# EAGLE schematic Proto Business Card (EAGLE 7.3.0)
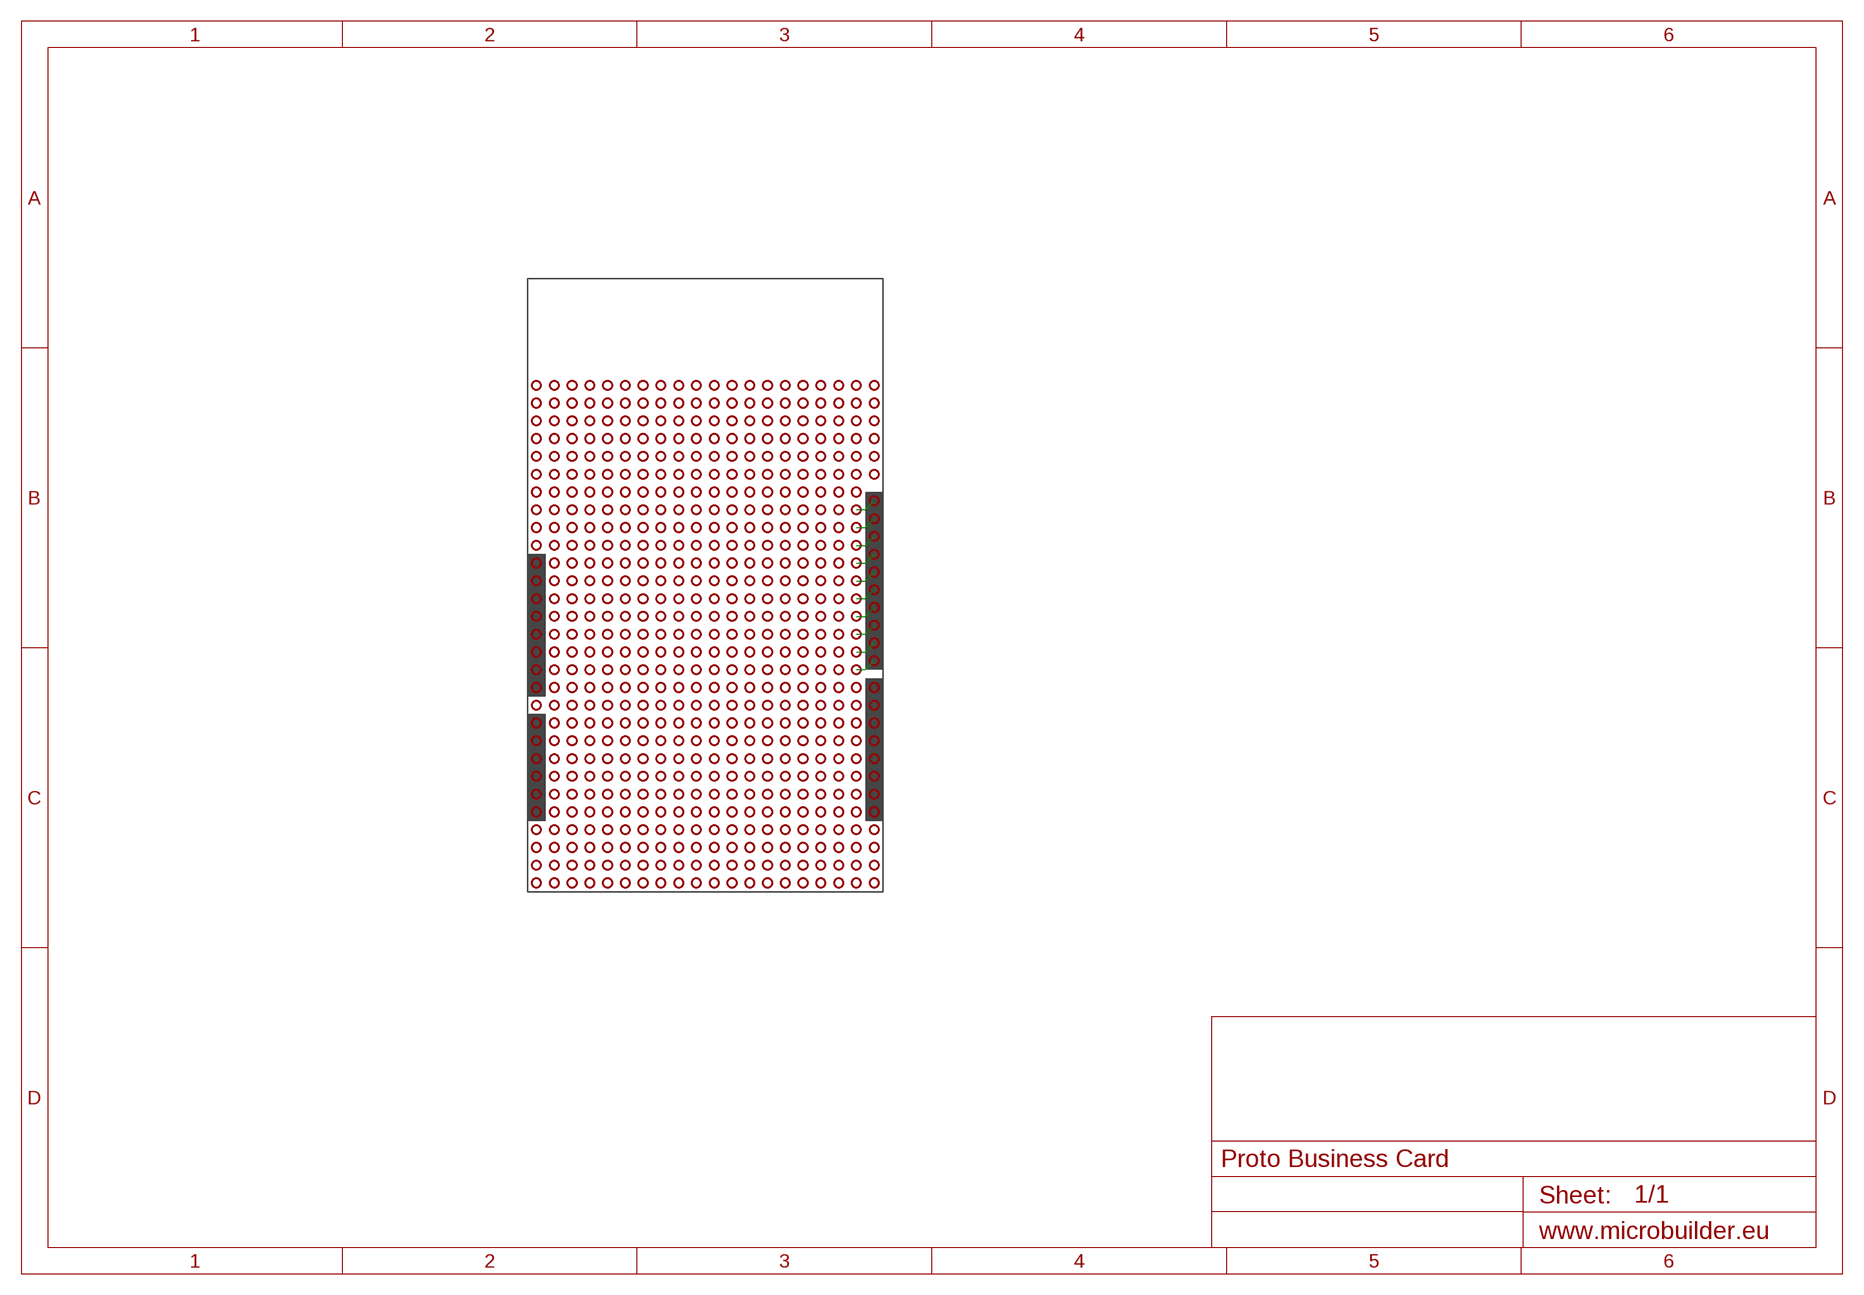
[diagram p0: schematic, sheet 1]

## Parts
U$1  VIA.2-2.CORNER  [2-2.CORNER]
U$2  VIA.3-3  [3-3]
U$3  VIA.2-2.CORNER  [2-2.CORNER]
U$4  VIA.3-3  [3-3]
U$5  VIA.3-3  [3-3]
U$6  VIA.3-3  [3-3]
U$7  VIA.3-3  [3-3]
U$8  VIA.3-3  [3-3]
U$9  VIA.3-3  [3-3]
U$10  VIA.3-3  [3-3]
U$11  VIA.3-3  [3-3]
U$12  VIA.3-3  [3-3]
U$13  VIA.3-3  [3-3]
U$14  VIA.3-3  [3-3]
U$15  VIA.3-3  [3-3]
U$16  VIA.3-3  [3-3]
U$17  VIA.3-3  [3-3]
U$18  VIA.3-3  [3-3]
U$19  VIA.3-3  [3-3]
U$20  VIA.3-3  [3-3]
U$21  VIA.2-2.CORNER  [2-2.CORNER]
U$22  VIA.3-3  [3-3]
U$23  VIA.3-3  [3-3]
U$24  VIA.3-3  [3-3]
U$25  VIA.3-3  [3-3]
U$26  VIA.3-3  [3-3]
U$27  VIA.3-3  [3-3]
U$28  VIA.3-3  [3-3]
U$29  VIA.3-3  [3-3]
U$30  VIA.3-3  [3-3]
U$31  VIA.3-3  [3-3]
U$32  VIA.3-3  [3-3]
U$33  VIA.3-3  [3-3]
U$34  VIA.3-3  [3-3]
U$35  VIA.3-3  [3-3]
U$36  VIA.3-3  [3-3]
U$37  VIA.2-2.CORNER  [2-2.CORNER]
U$38  VIA.4-4  [4-4]
U$39  VIA.4-4  [4-4]
U$40  VIA.4-4  [4-4]
U$41  VIA.4-4  [4-4]
U$42  VIA.4-4  [4-4]
U$43  VIA.4-4  [4-4]
U$44  VIA.4-4  [4-4]
U$45  VIA.3-3  [3-3]
U$46  VIA.3-3  [3-3]
U$47  VIA.4-4  [4-4]
U$48  VIA.4-4  [4-4]
U$49  VIA.4-4  [4-4]
U$50  VIA.4-4  [4-4]
U$51  VIA.4-4  [4-4]
U$52  VIA.4-4  [4-4]
U$53  VIA.4-4  [4-4]
U$54  VIA.4-4  [4-4]
U$55  VIA.4-4  [4-4]
U$56  VIA.4-4  [4-4]
U$57  VIA.4-4  [4-4]
U$58  VIA.4-4  [4-4]
U$59  VIA.4-4  [4-4]
U$60  VIA.4-4  [4-4]
U$61  VIA.4-4  [4-4]
U$62  VIA.4-4  [4-4]
U$63  VIA.4-4  [4-4]
U$64  VIA.4-4  [4-4]
U$65  VIA.4-4  [4-4]
U$66  VIA.4-4  [4-4]
U$67  VIA.4-4  [4-4]
U$68  VIA.4-4  [4-4]
U$69  VIA.4-4  [4-4]
U$70  VIA.4-4  [4-4]
U$71  VIA.4-4  [4-4]
U$72  VIA.4-4  [4-4]
U$73  VIA.4-4  [4-4]
U$74  VIA.NONE  [NONE]
U$75  VIA.NONE  [NONE]
U$76  VIA.4-4  [4-4]
U$77  VIA.3-3  [3-3]
U$78  VIA.3-3  [3-3]
U$79  VIA.4-4  [4-4]
U$80  VIA.4-4  [4-4]
U$81  VIA.4-4  [4-4]
U$82  VIA.4-4  [4-4]
U$83  VIA.4-4  [4-4]
U$84  VIA.4-4  [4-4]
U$85  VIA.4-4  [4-4]
U$86  VIA.4-4  [4-4]
U$87  VIA.4-4  [4-4]
U$88  VIA.4-4  [4-4]
U$89  VIA.4-4  [4-4]
U$90  VIA.4-4  [4-4]
U$91  VIA.4-4  [4-4]
U$92  VIA.4-4  [4-4]
U$93  VIA.4-4  [4-4]
U$94  VIA.4-4  [4-4]
U$95  VIA.NONE  [NONE]
U$96  VIA.NONE  [NONE]
U$97  VIA.NONE  [NONE]
U$98  VIA.NONE  [NONE]
U$99  VIA.NONE  [NONE]
U$100  VIA.NONE  [NONE]
U$101  VIA.4-4  [4-4]
U$102  VIA.4-4  [4-4]
U$103  VIA.4-4  [4-4]
U$104  VIA.4-4  [4-4]
U$105  VIA.4-4  [4-4]
U$106  VIA.4-4  [4-4]
U$107  VIA.4-4  [4-4]
U$108  VIA.4-4  [4-4]
U$109  VIA.4-4  [4-4]
U$110  VIA.4-4  [4-4]
U$111  VIA.4-4  [4-4]
U$112  VIA.3-3  [3-3]
U$113  VIA.3-3  [3-3]
U$114  VIA.4-4  [4-4]
U$115  VIA.4-4  [4-4]
U$116  VIA.4-4  [4-4]
U$117  VIA.4-4  [4-4]
U$118  VIA.4-4  [4-4]
U$119  VIA.4-4  [4-4]
U$120  VIA.3-3  [3-3]
U$121  VIA.3-3  [3-3]
U$122  VIA.3-3  [3-3]
U$123  VIA.3-3  [3-3]
U$124  VIA.3-3  [3-3]
U$125  VIA.3-3  [3-3]
U$126  VIA.4-4  [4-4]
U$127  VIA.4-4  [4-4]
U$128  VIA.4-4  [4-4]
U$129  VIA.4-4  [4-4]
U$130  VIA.4-4  [4-4]
U$131  VIA.4-4  [4-4]
U$132  VIA.4-4  [4-4]
U$133  VIA.4-4  [4-4]
U$134  VIA.4-4  [4-4]
U$135  VIA.4-4  [4-4]
U$136  VIA.4-4  [4-4]
U$137  VIA.4-4  [4-4]
U$138  VIA.4-4  [4-4]
U$139  VIA.4-4  [4-4]
U$140  VIA.4-4  [4-4]
U$141  VIA.4-4  [4-4]
U$142  VIA.4-4  [4-4]
U$143  VIA.4-4  [4-4]
U$144  VIA.4-4  [4-4]
U$145  VIA.3-3  [3-3]
U$146  VIA.3-3  [3-3]
U$147  VIA.4-4  [4-4]
U$148  VIA.NONE  [NONE]
U$149  VIA.NONE  [NONE]
U$150  VIA.3-3  [3-3]
U$151  VIA.4-4  [4-4]
U$152  VIA.3-3  [3-3]
U$153  VIA.3-3  [3-3]
U$154  VIA.4-4  [4-4]
U$155  VIA.4-4  [4-4]
U$156  VIA.4-4  [4-4]
U$157  VIA.4-4  [4-4]
U$158  VIA.4-4  [4-4]
U$159  VIA.4-4  [4-4]
U$160  VIA.4-4  [4-4]
U$161  VIA.4-4  [4-4]
U$162  VIA.4-4  [4-4]
U$163  VIA.4-4  [4-4]
U$164  VIA.4-4  [4-4]
U$165  VIA.4-4  [4-4]
U$166  VIA.4-4  [4-4]
U$167  VIA.4-4  [4-4]
U$168  VIA.4-4  [4-4]
U$169  VIA.4-4  [4-4]
U$170  VIA.3-3  [3-3]
U$171  VIA.4-4  [4-4]
U$172  VIA.4-4  [4-4]
U$173  VIA.4-4  [4-4]
U$174  VIA.4-4  [4-4]
U$175  VIA.4-4  [4-4]
U$176  VIA.4-4  [4-4]
U$177  VIA.4-4  [4-4]
U$178  VIA.4-4  [4-4]
U$179  VIA.4-4  [4-4]
U$180  VIA.4-4  [4-4]
U$181  VIA.4-4  [4-4]
U$182  VIA.3-3  [3-3]
U$183  VIA.3-3  [3-3]
U$184  VIA.4-4  [4-4]
U$185  VIA.4-4  [4-4]
U$186  VIA.4-4  [4-4]
U$187  VIA.4-4  [4-4]
U$188  VIA.4-4  [4-4]
U$189  VIA.4-4  [4-4]
U$190  VIA.4-4  [4-4]
U$191  VIA.4-4  [4-4]
U$192  VIA.4-4  [4-4]
U$193  VIA.4-4  [4-4]
U$194  VIA.4-4  [4-4]
U$195  VIA.4-4  [4-4]
U$196  VIA.4-4  [4-4]
U$197  VIA.4-4  [4-4]
U$198  VIA.4-4  [4-4]
U$199  VIA.4-4  [4-4]
U$200  VIA.4-4  [4-4]
U$201  VIA.4-4  [4-4]
U$202  VIA.4-4  [4-4]
U$203  VIA.4-4  [4-4]
U$204  VIA.4-4  [4-4]
U$205  VIA.4-4  [4-4]
U$206  VIA.4-4  [4-4]
U$207  VIA.4-4  [4-4]
U$208  VIA.4-4  [4-4]
U$209  VIA.4-4  [4-4]
U$210  VIA.4-4  [4-4]
U$211  VIA.3-3  [3-3]
U$212  VIA.3-3  [3-3]
U$213  VIA.4-4  [4-4]
U$214  VIA.4-4  [4-4]
U$215  VIA.4-4  [4-4]
U$216  VIA.4-4  [4-4]
U$217  VIA.4-4  [4-4]
U$218  VIA.4-4  [4-4]
U$219  VIA.4-4  [4-4]
U$220  VIA.4-4  [4-4]
U$221  VIA.4-4  [4-4]
U$222  VIA.4-4  [4-4]
U$223  VIA.4-4  [4-4]
U$224  VIA.4-4  [4-4]
U$225  VIA.4-4  [4-4]
U$226  VIA.4-4  [4-4]
U$227  VIA.4-4  [4-4]
U$228  VIA.4-4  [4-4]
U$229  VIA.4-4  [4-4]
U$230  VIA.4-4  [4-4]
U$231  VIA.4-4  [4-4]
U$232  VIA.4-4  [4-4]
U$233  VIA.4-4  [4-4]
U$234  VIA.4-4  [4-4]
U$235  VIA.4-4  [4-4]
U$236  VIA.4-4  [4-4]
U$237  VIA.4-4  [4-4]
U$238  VIA.4-4  [4-4]
U$239  VIA.4-4  [4-4]
U$240  VIA.3-3  [3-3]
U$241  VIA.3-3  [3-3]
U$242  VIA.4-4  [4-4]
U$243  VIA.4-4  [4-4]
U$244  VIA.4-4  [4-4]
U$245  VIA.4-4  [4-4]
U$246  VIA.4-4  [4-4]
U$247  VIA.4-4  [4-4]
U$248  VIA.4-4  [4-4]
U$249  VIA.4-4  [4-4]
U$250  VIA.4-4  [4-4]
U$251  VIA.4-4  [4-4]
U$252  VIA.4-4  [4-4]
U$253  VIA.4-4  [4-4]
U$254  VIA.4-4  [4-4]
U$255  VIA.4-4  [4-4]
U$256  VIA.4-4  [4-4]
U$257  VIA.4-4  [4-4]
U$258  VIA.4-4  [4-4]
U$259  VIA.4-4  [4-4]
U$260  VIA.4-4  [4-4]
U$261  VIA.4-4  [4-4]
U$262  VIA.4-4  [4-4]
U$263  VIA.4-4  [4-4]
U$264  VIA.4-4  [4-4]
U$265  VIA.4-4  [4-4]
U$266  VIA.4-4  [4-4]
U$267  VIA.4-4  [4-4]
U$268  VIA.4-4  [4-4]
U$269  VIA.3-3  [3-3]
U$270  VIA.3-3  [3-3]
U$271  VIA.4-4  [4-4]
U$272  VIA.4-4  [4-4]
U$273  VIA.4-4  [4-4]
U$274  VIA.4-4  [4-4]
U$275  VIA.4-4  [4-4]
U$276  VIA.4-4  [4-4]
U$277  VIA.4-4  [4-4]
U$278  VIA.4-4  [4-4]
U$279  VIA.4-4  [4-4]
U$280  VIA.4-4  [4-4]
U$281  VIA.4-4  [4-4]
U$282  VIA.4-4  [4-4]
U$283  VIA.4-4  [4-4]
U$284  VIA.4-4  [4-4]
U$285  VIA.4-4  [4-4]
U$286  VIA.4-4  [4-4]
U$287  VIA.4-4  [4-4]
U$288  VIA.4-4  [4-4]
U$289  VIA.4-4  [4-4]
U$290  VIA.4-4  [4-4]
U$291  VIA.4-4  [4-4]
U$292  VIA.4-4  [4-4]
U$293  VIA.4-4  [4-4]
U$294  VIA.4-4  [4-4]
U$295  VIA.4-4  [4-4]
U$296  VIA.4-4  [4-4]
U$297  VIA.4-4  [4-4]
U$298  VIA.3-3  [3-3]
U$299  VIA.3-3  [3-3]
U$300  VIA.4-4  [4-4]
U$301  VIA.4-4  [4-4]
U$302  VIA.4-4  [4-4]
U$303  VIA.4-4  [4-4]
U$304  VIA.4-4  [4-4]
U$305  VIA.4-4  [4-4]
U$306  VIA.4-4  [4-4]
U$307  VIA.4-4  [4-4]
U$308  VIA.4-4  [4-4]
U$309  VIA.4-4  [4-4]
U$310  VIA.4-4  [4-4]
U$311  VIA.4-4  [4-4]
U$312  VIA.4-4  [4-4]
U$313  VIA.4-4  [4-4]
U$314  VIA.4-4  [4-4]
U$315  VIA.4-4  [4-4]
U$316  VIA.4-4  [4-4]
U$317  VIA.4-4  [4-4]
U$318  VIA.4-4  [4-4]
U$319  VIA.4-4  [4-4]
U$320  VIA.4-4  [4-4]
U$321  VIA.4-4  [4-4]
U$322  VIA.4-4  [4-4]
U$323  VIA.4-4  [4-4]
U$324  VIA.4-4  [4-4]
U$325  VIA.4-4  [4-4]
U$326  VIA.4-4  [4-4]
U$327  VIA.3-3  [3-3]
U$328  VIA.3-3  [3-3]
U$329  VIA.4-4  [4-4]
U$330  VIA.4-4  [4-4]
U$331  VIA.4-4  [4-4]
U$332  VIA.4-4  [4-4]
U$333  VIA.4-4  [4-4]
U$334  VIA.4-4  [4-4]
U$335  VIA.4-4  [4-4]
U$336  VIA.4-4  [4-4]
U$337  VIA.4-4  [4-4]
U$338  VIA.4-4  [4-4]
U$339  VIA.4-4  [4-4]
U$340  VIA.4-4  [4-4]
U$341  VIA.4-4  [4-4]
U$342  VIA.4-4  [4-4]
U$343  VIA.4-4  [4-4]
U$344  VIA.4-4  [4-4]
U$345  VIA.4-4  [4-4]
U$346  VIA.4-4  [4-4]
U$347  VIA.4-4  [4-4]
U$348  VIA.4-4  [4-4]
U$349  VIA.4-4  [4-4]
U$350  VIA.4-4  [4-4]
U$351  VIA.4-4  [4-4]
U$352  VIA.4-4  [4-4]
U$353  VIA.4-4  [4-4]
U$354  VIA.4-4  [4-4]
U$355  VIA.4-4  [4-4]
U$356  VIA.3-3  [3-3]
U$357  VIA.3-3  [3-3]
U$358  VIA.4-4  [4-4]
U$359  VIA.4-4  [4-4]
U$360  VIA.4-4  [4-4]
U$361  VIA.4-4  [4-4]
U$362  VIA.4-4  [4-4]
U$363  VIA.4-4  [4-4]
U$364  VIA.4-4  [4-4]
U$365  VIA.4-4  [4-4]
U$366  VIA.4-4  [4-4]
U$367  VIA.4-4  [4-4]
U$368  VIA.4-4  [4-4]
U$369  VIA.4-4  [4-4]
U$370  VIA.4-4  [4-4]
U$371  VIA.4-4  [4-4]
U$372  VIA.4-4  [4-4]
U$373  VIA.4-4  [4-4]
U$374  VIA.4-4  [4-4]
U$375  VIA.4-4  [4-4]
U$376  VIA.4-4  [4-4]
U$377  VIA.4-4  [4-4]
U$378  VIA.4-4  [4-4]
U$379  VIA.4-4  [4-4]
U$380  VIA.4-4  [4-4]
U$381  VIA.4-4  [4-4]
U$382  VIA.4-4  [4-4]
U$383  VIA.4-4  [4-4]
U$384  VIA.4-4  [4-4]
U$385  VIA.3-3  [3-3]
U$386  VIA.3-3  [3-3]
U$387  VIA.4-4  [4-4]
U$388  VIA.4-4  [4-4]
U$389  VIA.4-4  [4-4]
U$390  VIA.4-4  [4-4]
U$391  VIA.4-4  [4-4]
U$392  VIA.4-4  [4-4]
U$393  VIA.4-4  [4-4]
U$394  VIA.4-4  [4-4]
U$395  VIA.4-4  [4-4]
U$396  VIA.4-4  [4-4]
U$397  VIA.4-4  [4-4]
U$398  VIA.4-4  [4-4]
U$399  VIA.4-4  [4-4]
U$400  VIA.4-4  [4-4]
U$401  VIA.4-4  [4-4]
U$402  VIA.4-4  [4-4]
U$403  VIA.4-4  [4-4]
U$404  VIA.4-4  [4-4]
U$405  VIA.4-4  [4-4]
U$406  VIA.4-4  [4-4]
U$407  VIA.4-4  [4-4]
U$408  VIA.4-4  [4-4]
U$409  VIA.4-4  [4-4]
U$410  VIA.4-4  [4-4]
U$411  VIA.4-4  [4-4]
U$412  VIA.4-4  [4-4]
U$413  VIA.4-4  [4-4]
U$414  VIA.3-3  [3-3]
U$415  VIA.3-3  [3-3]
U$416  VIA.4-4  [4-4]
U$417  VIA.4-4  [4-4]
U$418  VIA.4-4  [4-4]
U$419  VIA.4-4  [4-4]
U$420  VIA.4-4  [4-4]
U$421  VIA.4-4  [4-4]
U$422  VIA.4-4  [4-4]
U$423  VIA.4-4  [4-4]
U$424  VIA.4-4  [4-4]
U$425  VIA.4-4  [4-4]
U$426  VIA.4-4  [4-4]
U$427  VIA.4-4  [4-4]
U$428  VIA.4-4  [4-4]
U$429  VIA.4-4  [4-4]
U$430  VIA.4-4  [4-4]
U$431  VIA.4-4  [4-4]
U$432  VIA.4-4  [4-4]
U$433  VIA.4-4  [4-4]
U$434  VIA.4-4  [4-4]
U$435  VIA.4-4  [4-4]
U$436  VIA.4-4  [4-4]
U$437  VIA.4-4  [4-4]
U$438  VIA.4-4  [4-4]
U$439  VIA.4-4  [4-4]
U$440  VIA.4-4  [4-4]
U$441  VIA.4-4  [4-4]
U$442  VIA.4-4  [4-4]
U$443  VIA.3-3  [3-3]
U$444  VIA.3-3  [3-3]
U$445  VIA.4-4  [4-4]
U$446  VIA.4-4  [4-4]
U$447  VIA.4-4  [4-4]
U$448  VIA.4-4  [4-4]
U$449  VIA.4-4  [4-4]
U$450  VIA.4-4  [4-4]
U$451  VIA.4-4  [4-4]
U$452  VIA.4-4  [4-4]
U$453  VIA.4-4  [4-4]
U$454  VIA.4-4  [4-4]
U$455  VIA.4-4  [4-4]
U$456  VIA.4-4  [4-4]
U$457  VIA.4-4  [4-4]
U$458  VIA.4-4  [4-4]
U$459  VIA.4-4  [4-4]
U$460  VIA.4-4  [4-4]
U$461  VIA.4-4  [4-4]
U$462  VIA.4-4  [4-4]
U$463  VIA.4-4  [4-4]
U$464  VIA.4-4  [4-4]
U$465  VIA.4-4  [4-4]
U$466  VIA.4-4  [4-4]
U$467  VIA.4-4  [4-4]
U$468  VIA.4-4  [4-4]
U$469  VIA.4-4  [4-4]
U$470  VIA.4-4  [4-4]
U$471  VIA.4-4  [4-4]
U$472  VIA.3-3  [3-3]
U$473  VIA.3-3  [3-3]
U$474  VIA.4-4  [4-4]
U$475  VIA.4-4  [4-4]
U$476  VIA.4-4  [4-4]
U$477  VIA.4-4  [4-4]
U$478  VIA.4-4  [4-4]
U$479  VIA.4-4  [4-4]
U$480  VIA.4-4  [4-4]
U$481  VIA.4-4  [4-4]
U$482  VIA.4-4  [4-4]
U$483  VIA.4-4  [4-4]
U$484  VIA.4-4  [4-4]
U$485  VIA.4-4  [4-4]
U$486  VIA.4-4  [4-4]
U$487  VIA.4-4  [4-4]
U$488  VIA.4-4  [4-4]
U$489  VIA.4-4  [4-4]
U$490  VIA.4-4  [4-4]
U$491  VIA.4-4  [4-4]
U$492  VIA.4-4  [4-4]
U$493  VIA.4-4  [4-4]
U$494  VIA.4-4  [4-4]
U$495  VIA.4-4  [4-4]
U$496  VIA.4-4  [4-4]
U$497  VIA.4-4  [4-4]
U$498  VIA.4-4  [4-4]
U$499  VIA.4-4  [4-4]
U$500  VIA.4-4  [4-4]
U$501  VIA.3-3  [3-3]
U$502  VIA.3-3  [3-3]
U$503  VIA.4-4  [4-4]
U$504  VIA.4-4  [4-4]
U$505  VIA.4-4  [4-4]
U$506  VIA.4-4  [4-4]
U$507  VIA.4-4  [4-4]
U$508  VIA.4-4  [4-4]
U$509  VIA.4-4  [4-4]
U$510  VIA.4-4  [4-4]
U$511  VIA.4-4  [4-4]
U$512  VIA.4-4  [4-4]
U$513  VIA.4-4  [4-4]
U$514  VIA.4-4  [4-4]
U$515  VIA.4-4  [4-4]
U$516  VIA.4-4  [4-4]
U$517  VIA.4-4  [4-4]
U$518  VIA.4-4  [4-4]
U$519  VIA.4-4  [4-4]
U$520  VIA.4-4  [4-4]
U$521  VIA.4-4  [4-4]
U$522  VIA.4-4  [4-4]
U$523  VIA.4-4  [4-4]
U$524  VIA.4-4  [4-4]
U$525  VIA.4-4  [4-4]
U$526  VIA.4-4  [4-4]
U$527  VIA.4-4  [4-4]
U$528  VIA.4-4  [4-4]
U$529  VIA.4-4  [4-4]
U$530  VIA.3-3  [3-3]
U$531  VIA.3-3  [3-3]
U$532  VIA.4-4  [4-4]
U$533  VIA.4-4  [4-4]
U$534  VIA.4-4  [4-4]
U$535  VIA.4-4  [4-4]
U$536  VIA.4-4  [4-4]
U$537  VIA.4-4  [4-4]
U$538  VIA.4-4  [4-4]
U$539  VIA.4-4  [4-4]
U$540  VIA.4-4  [4-4]
U$541  VIA.4-4  [4-4]
U$542  VIA.4-4  [4-4]
U$543  VIA.4-4  [4-4]
U$544  VIA.4-4  [4-4]
U$545  VIA.4-4  [4-4]
U$546  VIA.4-4  [4-4]
U$547  VIA.4-4  [4-4]
U$548  VIA.4-4  [4-4]
U$549  VIA.4-4  [4-4]
U$550  VIA.4-4  [4-4]
U$551  VIA.4-4  [4-4]
U$552  VIA.4-4  [4-4]
U$553  VIA.4-4  [4-4]
U$554  VIA.4-4  [4-4]
U$555  VIA.4-4  [4-4]
U$556  VIA.4-4  [4-4]
U$557  VIA.4-4  [4-4]
U$558  VIA.4-4  [4-4]
U$559  VIA.3-3  [3-3]
U$560  VIA.3-3  [3-3]
U$561  VIA.4-4  [4-4]
U$562  VIA.4-4  [4-4]
U$563  VIA.4-4  [4-4]
U$564  VIA.4-4  [4-4]
U$565  VIA.4-4  [4-4]
U$566  VIA.3-3  [3-3]
U$567  VIA.3-3  [3-3]
U$568  VIA.3-3  [3-3]
U$569  VIA.3-3  [3-3]
U$570  VIA.2-2.CORNER  [2-2.CORNER]
U$571  VIA.3-3  [3-3]
U$572  VIA.3-3  [3-3]
U$573  VIA.3-3  [3-3]
U$574  VIA.2-2.CORNER  [2-2.CORNER]
U$575  VIA.3-3  [3-3]
U$585  VIA.4-4  [4-4]
U$586  VIA.4-4  [4-4]
U$587  VIA.4-4  [4-4]
U$588  VIA.3-3  [3-3]

## Nets
N$1: U$99.VIA U$145.VIA
N$2: U$100.VIA U$146.VIA
N$3: U$97.VIA U$124.VIA
N$4: U$98.VIA U$125.VIA
N$5: U$95.VIA U$122.VIA
N$6: U$96.VIA U$123.VIA
N$7: U$74.VIA U$120.VIA
N$8: U$75.VIA U$121.VIA
N$9: U$148.VIA U$150.VIA
N$10: U$149.VIA U$170.VIA
Unconnected: U$1.VIA U$2.VIA U$3.VIA U$4.VIA U$5.VIA U$6.VIA U$7.VIA U$8.VIA U$9.VIA U$10.VIA U$11.VIA U$12.VIA U$13.VIA U$14.VIA U$15.VIA U$16.VIA U$17.VIA U$18.VIA U$19.VIA U$20.VIA U$21.VIA U$22.VIA U$23.VIA U$24.VIA U$25.VIA U$26.VIA U$27.VIA U$28.VIA U$29.VIA U$30.VIA U$31.VIA U$32.VIA U$33.VIA U$34.VIA U$35.VIA U$36.VIA U$37.VIA U$38.VIA U$39.VIA U$40.VIA U$41.VIA U$42.VIA U$43.VIA U$44.VIA U$45.VIA U$46.VIA U$47.VIA U$48.VIA U$49.VIA U$50.VIA U$51.VIA U$52.VIA U$53.VIA U$54.VIA U$55.VIA U$56.VIA U$57.VIA U$58.VIA U$59.VIA U$60.VIA U$61.VIA U$62.VIA U$63.VIA U$64.VIA U$65.VIA U$66.VIA U$67.VIA U$68.VIA U$69.VIA U$70.VIA U$71.VIA U$72.VIA U$73.VIA U$76.VIA U$77.VIA U$78.VIA U$79.VIA U$80.VIA U$81.VIA U$82.VIA U$83.VIA U$84.VIA U$85.VIA U$86.VIA U$87.VIA U$88.VIA U$89.VIA U$90.VIA U$91.VIA U$92.VIA U$93.VIA U$94.VIA U$101.VIA U$102.VIA U$103.VIA U$104.VIA U$105.VIA U$106.VIA U$107.VIA U$108.VIA U$109.VIA U$110.VIA U$111.VIA U$112.VIA U$113.VIA U$114.VIA U$115.VIA U$116.VIA U$117.VIA U$118.VIA U$119.VIA U$126.VIA U$127.VIA U$128.VIA U$129.VIA U$130.VIA U$131.VIA U$132.VIA U$133.VIA U$134.VIA U$135.VIA U$136.VIA U$137.VIA U$138.VIA U$139.VIA U$140.VIA U$141.VIA U$142.VIA U$143.VIA U$144.VIA U$147.VIA U$151.VIA U$152.VIA U$153.VIA U$154.VIA U$155.VIA U$156.VIA U$157.VIA U$158.VIA U$159.VIA U$160.VIA U$161.VIA U$162.VIA U$163.VIA U$164.VIA U$165.VIA U$166.VIA U$167.VIA U$168.VIA U$169.VIA U$171.VIA U$172.VIA U$173.VIA U$174.VIA U$175.VIA U$176.VIA U$177.VIA U$178.VIA U$179.VIA U$180.VIA U$181.VIA U$182.VIA U$183.VIA U$184.VIA U$185.VIA U$186.VIA U$187.VIA U$188.VIA U$189.VIA U$190.VIA U$191.VIA U$192.VIA U$193.VIA U$194.VIA U$195.VIA U$196.VIA U$197.VIA U$198.VIA U$199.VIA U$200.VIA U$201.VIA U$202.VIA U$203.VIA U$204.VIA U$205.VIA U$206.VIA U$207.VIA U$208.VIA U$209.VIA U$210.VIA U$211.VIA U$212.VIA U$213.VIA U$214.VIA U$215.VIA U$216.VIA U$217.VIA U$218.VIA U$219.VIA U$220.VIA U$221.VIA U$222.VIA U$223.VIA U$224.VIA U$225.VIA U$226.VIA U$227.VIA U$228.VIA U$229.VIA U$230.VIA U$231.VIA U$232.VIA U$233.VIA U$234.VIA U$235.VIA U$236.VIA U$237.VIA U$238.VIA U$239.VIA U$240.VIA U$241.VIA U$242.VIA U$243.VIA U$244.VIA U$245.VIA U$246.VIA U$247.VIA U$248.VIA U$249.VIA U$250.VIA U$251.VIA U$252.VIA U$253.VIA U$254.VIA U$255.VIA U$256.VIA U$257.VIA U$258.VIA U$259.VIA U$260.VIA U$261.VIA U$262.VIA U$263.VIA U$264.VIA U$265.VIA U$266.VIA U$267.VIA U$268.VIA U$269.VIA U$270.VIA U$271.VIA U$272.VIA U$273.VIA U$274.VIA U$275.VIA U$276.VIA U$277.VIA U$278.VIA U$279.VIA U$280.VIA U$281.VIA U$282.VIA U$283.VIA U$284.VIA U$285.VIA U$286.VIA U$287.VIA U$288.VIA U$289.VIA U$290.VIA U$291.VIA U$292.VIA U$293.VIA U$294.VIA U$295.VIA U$296.VIA U$297.VIA U$298.VIA U$299.VIA U$300.VIA U$301.VIA U$302.VIA U$303.VIA U$304.VIA U$305.VIA U$306.VIA U$307.VIA U$308.VIA U$309.VIA U$310.VIA U$311.VIA U$312.VIA U$313.VIA U$314.VIA U$315.VIA U$316.VIA U$317.VIA U$318.VIA U$319.VIA U$320.VIA U$321.VIA U$322.VIA U$323.VIA U$324.VIA U$325.VIA U$326.VIA U$327.VIA U$328.VIA U$329.VIA U$330.VIA U$331.VIA U$332.VIA U$333.VIA U$334.VIA U$335.VIA U$336.VIA U$337.VIA U$338.VIA U$339.VIA U$340.VIA U$341.VIA U$342.VIA U$343.VIA U$344.VIA U$345.VIA U$346.VIA U$347.VIA U$348.VIA U$349.VIA U$350.VIA U$351.VIA U$352.VIA U$353.VIA U$354.VIA U$355.VIA U$356.VIA U$357.VIA U$358.VIA U$359.VIA U$360.VIA U$361.VIA U$362.VIA U$363.VIA U$364.VIA U$365.VIA U$366.VIA U$367.VIA U$368.VIA U$369.VIA U$370.VIA U$371.VIA U$372.VIA U$373.VIA U$374.VIA U$375.VIA U$376.VIA U$377.VIA U$378.VIA U$379.VIA U$380.VIA U$381.VIA U$382.VIA U$383.VIA U$384.VIA U$385.VIA U$386.VIA U$387.VIA U$388.VIA U$389.VIA U$390.VIA U$391.VIA U$392.VIA U$393.VIA U$394.VIA U$395.VIA U$396.VIA U$397.VIA U$398.VIA U$399.VIA U$400.VIA U$401.VIA U$402.VIA U$403.VIA U$404.VIA U$405.VIA U$406.VIA U$407.VIA U$408.VIA U$409.VIA U$410.VIA U$411.VIA U$412.VIA U$413.VIA U$414.VIA U$415.VIA U$416.VIA U$417.VIA U$418.VIA U$419.VIA U$420.VIA U$421.VIA U$422.VIA U$423.VIA U$424.VIA U$425.VIA U$426.VIA U$427.VIA U$428.VIA U$429.VIA U$430.VIA U$431.VIA U$432.VIA U$433.VIA U$434.VIA U$435.VIA U$436.VIA U$437.VIA U$438.VIA U$439.VIA U$440.VIA U$441.VIA U$442.VIA U$443.VIA U$444.VIA U$445.VIA U$446.VIA U$447.VIA U$448.VIA U$449.VIA U$450.VIA U$451.VIA U$452.VIA U$453.VIA U$454.VIA U$455.VIA U$456.VIA U$457.VIA U$458.VIA U$459.VIA U$460.VIA U$461.VIA U$462.VIA U$463.VIA U$464.VIA U$465.VIA U$466.VIA U$467.VIA U$468.VIA U$469.VIA U$470.VIA U$471.VIA U$472.VIA U$473.VIA U$474.VIA U$475.VIA U$476.VIA U$477.VIA U$478.VIA U$479.VIA U$480.VIA U$481.VIA U$482.VIA U$483.VIA U$484.VIA U$485.VIA U$486.VIA U$487.VIA U$488.VIA U$489.VIA U$490.VIA U$491.VIA U$492.VIA U$493.VIA U$494.VIA U$495.VIA U$496.VIA U$497.VIA U$498.VIA U$499.VIA U$500.VIA U$501.VIA U$502.VIA U$503.VIA U$504.VIA U$505.VIA U$506.VIA U$507.VIA U$508.VIA U$509.VIA U$510.VIA U$511.VIA U$512.VIA U$513.VIA U$514.VIA U$515.VIA U$516.VIA U$517.VIA U$518.VIA U$519.VIA U$520.VIA U$521.VIA U$522.VIA U$523.VIA U$524.VIA U$525.VIA U$526.VIA U$527.VIA U$528.VIA U$529.VIA U$530.VIA U$531.VIA U$532.VIA U$533.VIA U$534.VIA U$535.VIA U$536.VIA U$537.VIA U$538.VIA U$539.VIA U$540.VIA U$541.VIA U$542.VIA U$543.VIA U$544.VIA U$545.VIA U$546.VIA U$547.VIA U$548.VIA U$549.VIA U$550.VIA U$551.VIA U$552.VIA U$553.VIA U$554.VIA U$555.VIA U$556.VIA U$557.VIA U$558.VIA U$559.VIA U$560.VIA U$561.VIA U$562.VIA U$563.VIA U$564.VIA U$565.VIA U$566.VIA U$567.VIA U$568.VIA U$569.VIA U$570.VIA U$571.VIA U$572.VIA U$573.VIA U$574.VIA U$575.VIA U$585.VIA U$586.VIA U$587.VIA U$588.VIA

## Library data of the parts
U$1-U$575 U$585-U$588 = flowerpad:VIA